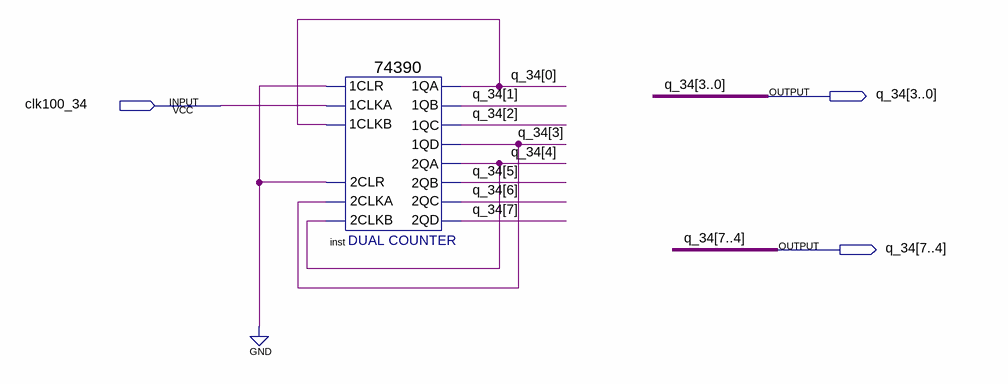
[diagram p0: schematic sheet]
// Quartus schematic cnt100.bdf as structural Verilog: 1 symbols, 3 pins
module cnt100 (
  input  clk100_34,
  output [7:0] q_34
);

  \74390  inst (
    .\2CLKA (q_34[3]), .\2CLR (1'b0), .\2CLKB (q_34[4]), .\1CLR (1'b0), .\1CLKA (clk100_34),
    .\1CLKB (q_34[0]), .\1QA (q_34[0]), .\1QB (q_34[1]), .\1QC (q_34[2]), .\1QD (q_34[3]), .\2QA (q_34[4]),
    .\2QB (q_34[5]), .\2QC (q_34[6]), .\2QD (q_34[7]));
endmodule
